# EAGLE design adapter (EAGLE 6.2)
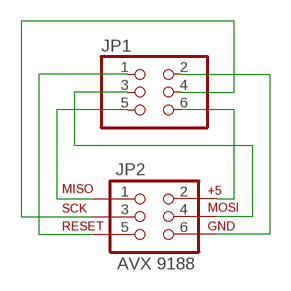
[diagram p0: schematic, sheet 1]

## Parts
JP1  PINHD-2X03_2.54-SMD  [2X03SMD]
JP2  AVX 9188  ISPTOUCH_ADAPTER  [AVX_9188_6-WAY_SMT]

## Nets
N$1: JP1.1 JP2.5
N$2: JP1.3 JP2.4
N$3: JP1.5 JP2.1
N$4: JP1.2 JP2.6
N$5: JP1.6 JP2.2
N$6: JP1.4 JP2.3

## Library data of the parts
JP1 = pinhead-2:PINHD-2X03: PIN HEADER
JP2 = daspilker:ISPTOUCH: ISPtouch for AVR Microcontrollers This 6-pin ISP connector for AVR programming does not require any part on the PCB, but an adapter for a common 6-pin programmer. http://daniel-spilker.com/blog/2011/04/25/isptouch-for-avr-microcontrollers/

## Board
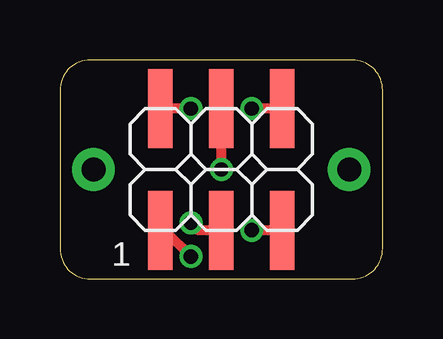
[diagram p1: board, top side]
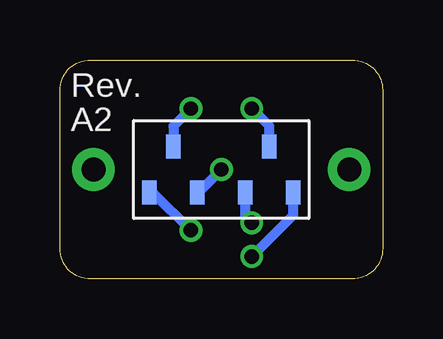
[diagram p2: board, bottom side, seen from below]

Size 13.46 x 9.14 mm. Coordinates in mm from the lower left corner, seen from the top.
Outline: 12.19,0 arc90 13.46,1.27 13.46,7.87 arc90 12.19,9.14 1.27,9.14 arc90 0,7.87 0,1.27 arc90 1.27,0 12.19,0
Copper layers (1*16): Top 0.0356mm / dielectric 1.5011mm / Bottom 0.0356mm
Design rules: minimum track width 6mil, minimum drill 13mil, track to track 6mil, track to pad 6mil, pad to pad 6mil, via to via 6mil, smd to smd 6mil, copper to edge 15mil, drill to drill 6mil, minimum pad ring 7mil, minimum via ring 7mil, stop-mask expansion 4mil, vias tented up to drill 0mil, thermal gap 10mil

### Footprints (pad centres in the part's own frame; a part is rotated, then mirrored left to right if it is on the bottom)
2X03SMD = smd 1.016 x 3.302: 1 -1.27,-3.81; 2 -1.27,1.27; 3 1.27,-3.81; 4 1.27,1.27; 5 3.81,-3.81; 6 3.81,1.27
AVX_9188_6-WAY_SMT = smd 0.6 x 1: 1 -3,-0.95; 2 -2,0.95; 3 -1,-0.95; 4 1,-0.95; 5 3,-0.95; 6 2,0.95

### Placement (x,y rotation side)
JP1  5.46,5.84 0 top
JP2  6.73,4.57 0 bottom

### Tracks (layer width: path | path; a pad name or v marks a point on that pad's centre or on a via)
N$1  (via drill 0.6)
  Top 0.406: JP1.1 4.38,2.03 | JP1.1 4.4,2.03 | JP1.1 4.37,2.03 v5.46,0.94
  Bottom 0.406: JP2.5 3.73,2.67 v5.46,0.94
N$2  (via drill 0.6)
  Top 0.406: JP1.3 5.78,2.03 v5.46,2.35
  Bottom 0.406: JP2.4 5.73,2.62 v5.46,2.35
N$3  (via drill 0.6)
  Top 0.406: JP1.5 v8,2.03
  Bottom 0.406: JP2.1 9.59,3.62 v8,2.03
N$4  (via drill 0.6)
  Top 0.406: v5.46,7.11 JP1.2
  Bottom 0.406: JP2.6 4.73,6.38 v5.46,7.11
N$5  (via drill 0.6)
  Top 0.406: JP1.6 v8,7.11
  Bottom 0.406: JP2.2 8.73,6.38 v8,7.11
N$6  (via drill 0.6)
  Top 0.406: v6.73,4.57 JP1.4
  Bottom 0.406: JP2.3 7.68,3.62 v6.73,4.57
N$7  (via drill 1 pad 1.78)
  other vias: 1.4,4.57
N$8  (via drill 1 pad 1.78)
  other vias: 12.06,4.57

### Text on the board
tPlace: 1
bPlace: Rev. | A2